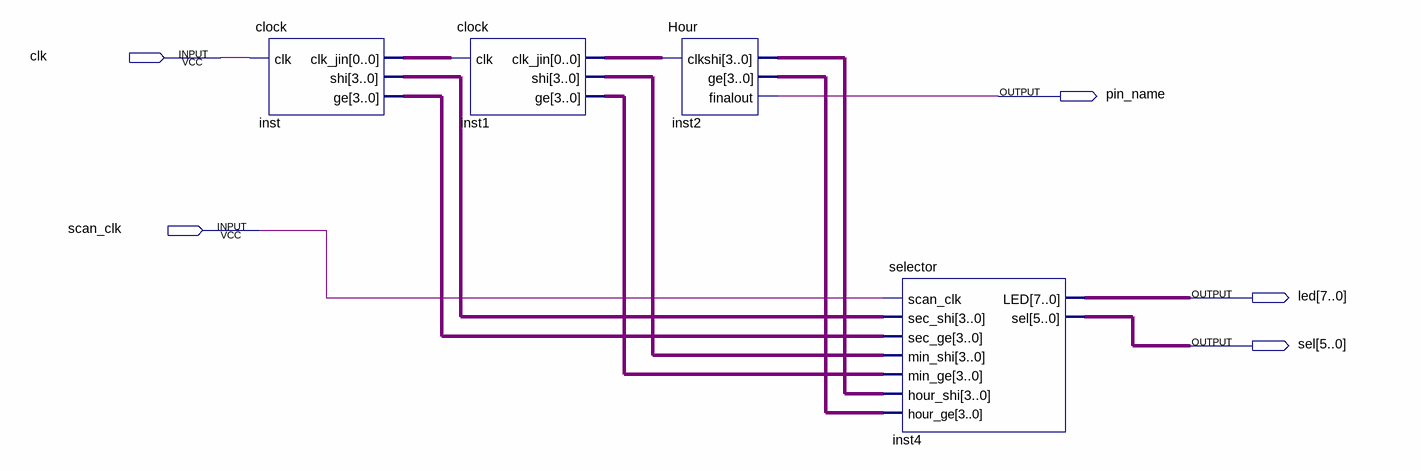
[diagram p0: schematic sheet]
// Quartus schematic MyClock.bdf as structural Verilog: 4 symbols, 5 pins
module MyClock (
  input  clk,
  input  scan_clk,
  output pin_name,
  output [7:0] led,
  output [5:0] sel
);

  wire inst1_clk_jin, inst_clk_jin;
  wire [3:0] inst1_ge, inst1_shi, inst2_ge, inst2_shi, inst_ge, inst_shi;

  clock inst (.clk(clk), .clk_jin(inst_clk_jin), .shi(inst_shi), .ge(inst_ge));
  clock inst1 (.clk(inst_clk_jin), .clk_jin(inst1_clk_jin), .shi(inst1_shi), .ge(inst1_ge));
  Hour inst2 (.clk(inst1_clk_jin), .shi(inst2_shi), .ge(inst2_ge), .finalout(pin_name));
  selector inst4 (
    .scan_clk(scan_clk), .sec_shi(inst_shi), .sec_ge(inst_ge), .min_shi(inst1_shi), .min_ge(inst1_ge),
    .hour_shi(inst2_shi), .hour_ge(inst2_ge), .LED(led), .sel(sel));
endmodule
